# EAGLE design Bus_Isolator (EAGLE 6.6.0)
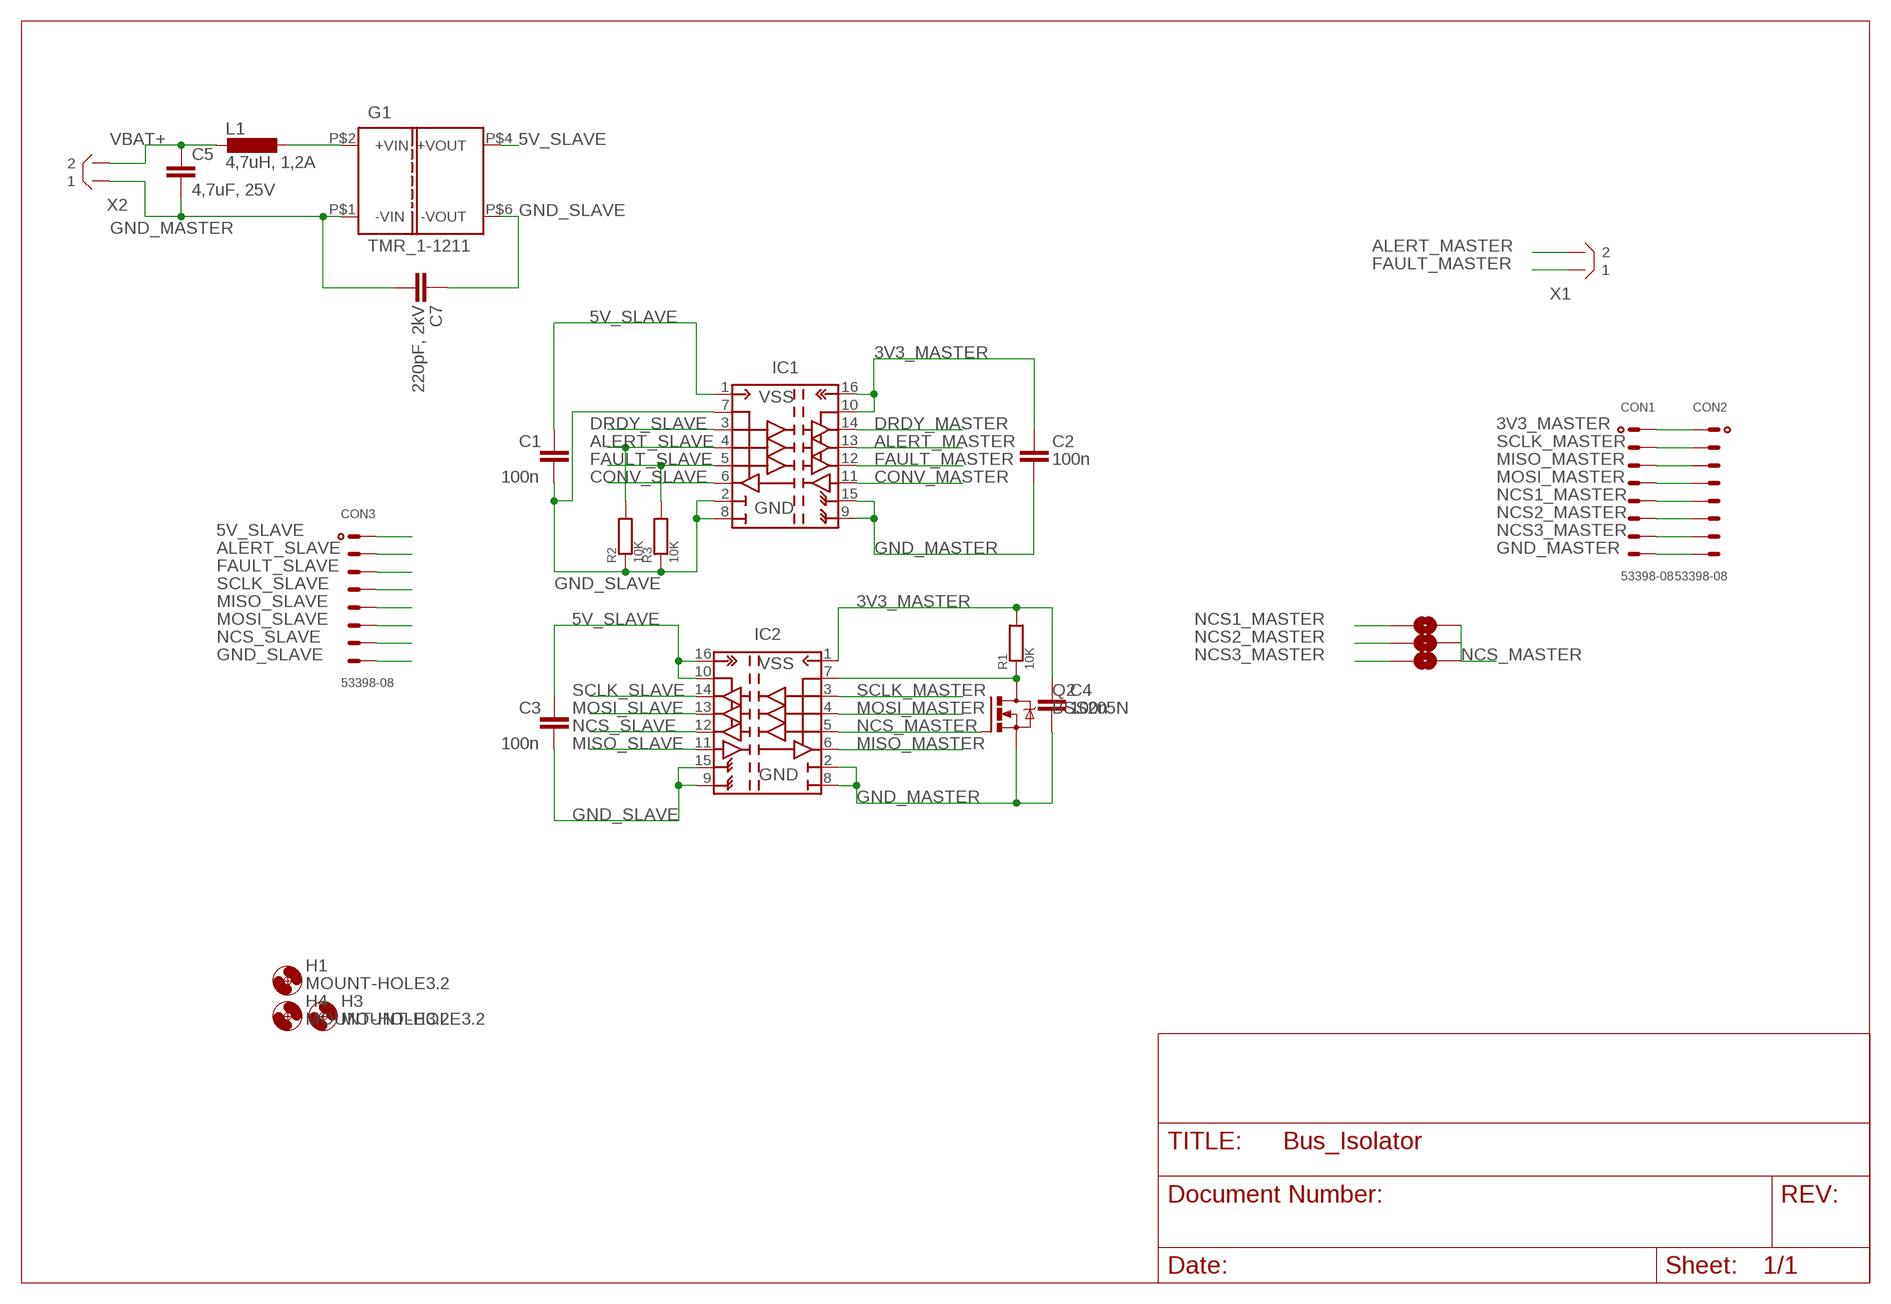
[diagram p0: schematic, sheet 1]

## Parts
C1  100n  CSTD  [C0805]
C2  100n  CSTD  [C0805]
C3  100n  CSTD  [C0805]
C4  100n  CSTD  [C0805]
C5  4,7uF, 25V  C-EUC0805  [C0805]
C7  220pF, 2kV  CC1210_HV  [C1210_HV]
CON1  53398-08  [53398-08]
CON2  53398-08  [53398-08]
CON3  53398-08  [53398-08]
G1  TMR_1-1211  TMR_1-1  [TMR_1-??1?]
H1  MOUNT-HOLE3.2  [3,2]
H3  MOUNT-HOLE3.2  [3,2]
H4  MOUNT-HOLE3.2  [3,2]
IC1  ISO7241  [R-PDSO-G16]
IC2  ISO7241  [R-PDSO-G16]
L1  4,7uH, 1,2A  L-EUL3225M  [L3225M]
Q2  BSS205N  [SOT23]
R1  10K  R  [R0805]
R2  10K  R  [R0805]
R3  10K  R  [R0805]
SJ1  SOLDERJUMPERNO  [SJ_2S-NO]
SJ2  SOLDERJUMPERNO  [SJ_2S-NO]
SJ4  SOLDERJUMPERNO  [SJ_2S-NO]
X1  B2B-XH  [B2B-XH]
X2  B2B-XH  [B2B-XH]

## Nets
3V3_MASTER: C2.2 C4.2 CON1.1 CON2.1 IC1.10(EN2) IC1.16(VCC2) IC2.1(VCC1) R1.2
5V_SLAVE: C1.2 C3.2 CON3.1 G1.P$4(+VOUT) IC1.1(VCC1) IC2.10(EN2) IC2.16(VCC2)
ALERT_MASTER: IC1.13(OUT_B) X1.P$2
ALERT_SLAVE: CON3.2 IC1.4(IN_B) R2.2
CONV_MASTER: IC1.11(IN_D)
CONV_SLAVE: IC1.6(OUT_D)
DRDY_MASTER: IC1.14(OUT_A)
DRDY_SLAVE: IC1.3(IN_A)
FAULT_MASTER: IC1.12(OUT_C) X1.P$1
FAULT_SLAVE: CON3.3 IC1.5(IN_C) R3.2
GND_MASTER: C2.1 C4.1 C5.2 C7.P$1 CON1.8 CON2.8 G1.P$1(-VIN) IC1.9(GND22) IC1.15(GND21) IC2.2(GND11) IC2.8(GND12) Q2.2(S) X2.P$1
GND_SLAVE: C1.1 C3.1 C7.P$2 CON3.8 G1.P$6(-VOUT) IC1.2(GND11) IC1.7(EN1) IC1.8(GND12) IC2.9(GND22) IC2.15(GND21) R2.1 R3.1
MISO_MASTER: CON1.3 CON2.3 IC2.6(OUT_D)
MISO_SLAVE: CON3.5 IC2.11(IN_D)
MOSI_MASTER: CON1.4 CON2.4 IC2.4(IN_B)
MOSI_SLAVE: CON3.6 IC2.13(OUT_B)
N$2: IC2.7(EN1) Q2.3(D) R1.1
N$5: G1.P$2(+VIN) L1.1
NCS1_MASTER: CON1.5 CON2.5 SJ1.1
NCS2_MASTER: CON1.6 CON2.6 SJ2.1
NCS3_MASTER: CON1.7 CON2.7 SJ4.1
NCS_MASTER: IC2.5(IN_C) Q2.1(G) SJ1.2 SJ2.2 SJ4.2
NCS_SLAVE: CON3.7 IC2.12(OUT_C)
SCLK_MASTER: CON1.2 CON2.2 IC2.3(IN_A)
SCLK_SLAVE: CON3.4 IC2.14(OUT_A)
VBAT+: C5.1 L1.2 X2.P$2

## Library data of the parts
C1-C4 C7 = useful:C
C5 = rcl:C-EU: CAPACITOR, European symbol
CON1-CON3 = con-molex:53?-08: CONNECTOR wire to board 1.25 mm (.049 inch) pitch header
G1 = traco-power:TMR_1-??1?
H1 H3 H4 = holes:MOUNT-HOLE: MOUNTING HOLE with drill center marker
IC1 IC2 = ti:ISO7241
L1 = rcl:L-EU: INDUCTOR, European symbol
Q2 = infineon:BSS205N: Infineon Small Signal Transistor, OptiMOS 2 Technology, 20V, 2.5A SOT23
R1-R3 = useful:R
SJ1 SJ2 SJ4 = jumper:SOLDERJUMPER: Solder Jumper Standard SMD solder jumper. Used to automate production. Two varients : Normally Open and Normally Closed are the same, but have different paste layers. NC will have a large amount of paste and should jumper during reflow.
X1 X2 = con-jst-xh:?2B-XH

## Board
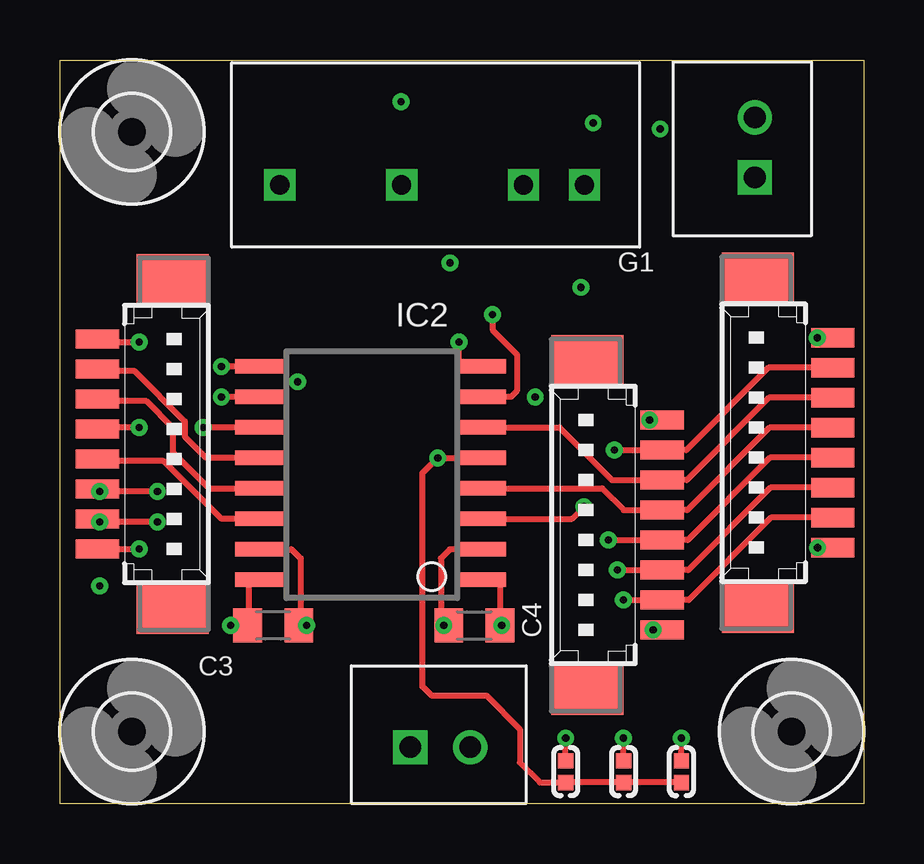
[diagram p1: board, top side]
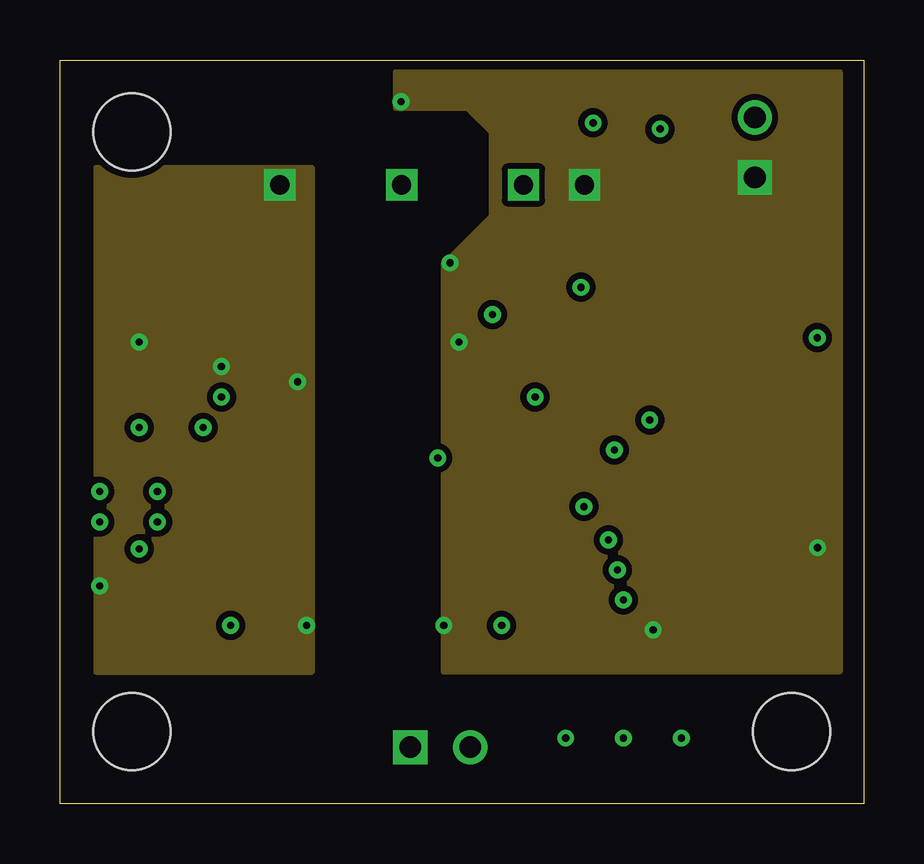
[diagram p2: board, inner layer Route2]
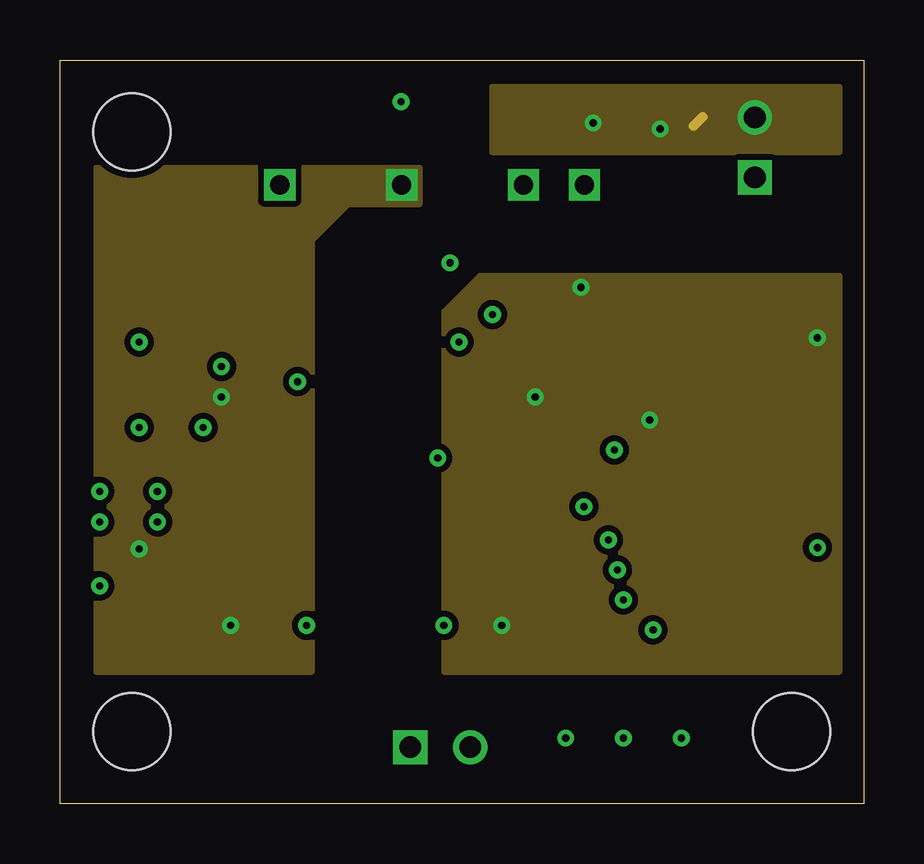
[diagram p3: board, inner layer Route15]
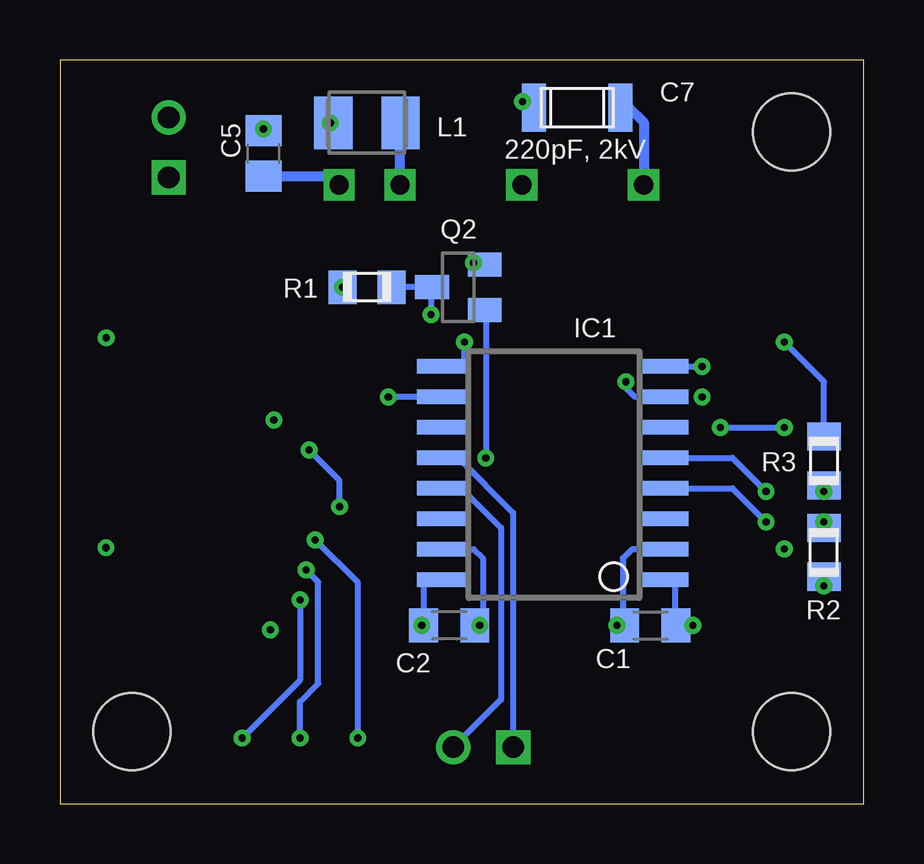
[diagram p4: board, bottom side, seen from below]

Size 33.5 x 31 mm. Coordinates in mm from the lower left corner, seen from the top.
Outline: 0,31 33.5,31 33.5,0 0,0 0,31
Copper layers (1+2*15+16): Top 0.035mm / dielectric 0.2mm / Route2 0.035mm / dielectric 0.5mm / Route15 0.035mm / dielectric 0.2mm / Bottom 0.035mm
Design rules "ats_35u_4layer_2 *": minimum track width 10mil, minimum drill 0.2mm, track to track 10mil, track to pad 10mil, pad to pad 10mil, via to via 10mil, smd to smd 10mil, copper to edge 0.3mm, drill to drill 8mil, minimum pad ring 10mil, minimum via ring 0.2mm, stop-mask expansion 4mil, vias tented up to drill 0mil, thermal gap 10mil

### Footprints (pad centres in the part's own frame; a part is rotated, then mirrored left to right if it is on the bottom)
C0805 = smd 1.2 x 1.4: 1 -1.066,0; 2 1.066,0
C0805' = smd 1.3 x 1.5: 1 -0.95,0; 2 0.95,0
C1210_HV = smd 1 x 2: P$1 -1.8,0; P$2 1.8,0
53398-08 = smd 0.8 x 1.8: 1 4.375,-2.5; 2 3.125,-2.5; 3 1.875,-2.5; 4 0.625,-2.5; 5 -0.625,-2.5; 6 -1.875,-2.5; 7 -3.125,-2.5; 8 -4.375,-2.5 | smd 2.1 x 3: S1 6.875,0.625; S2 -6.875,0.625
TMR_1-??1? = drill 0.8 square: P$1 0,0; P$2 2.54,0; P$4 7.62,0; P$6 12.7,0
3,2 = hole 3.2: 0,0
R-PDSO-G16 = smd 0.6 x 2: 1 -3.937,-4.649; 2 -2.667,-4.649; 3 -1.397,-4.649; 4 -0.127,-4.649; 5 1.143,-4.649; 6 2.413,-4.649; 7 3.683,-4.649; 8 4.953,-4.649; 9 4.953,4.651; 10 3.683,4.651; 11 2.413,4.651; 12 1.143,4.651; 13 -0.127,4.651; 14 -1.397,4.651; 15 -2.667,4.651; 16 -3.937,4.651
L3225M = smd 1.6 x 2.2: 1 -1.4,0; 2 1.4,0
SOT23 = smd 1 x 1.4: 1 -0.95,-1.1; 2 0.95,-1.1; 3 0,1.1
R0805 = smd 1.168 x 1.397: 1 -1.016,0; 2 1.016,0
SJ_2S-NO = smd 0.635 x 0.635: 1 -0.45,0; 2 0.45,0
B2B-XH = drill 0.9 pad 1.422 square: P$1 0,0 | drill 0.9 pad 1.422: P$2 2.5,0

### Placement (x,y rotation side)
C1  8.89,7.43 0 bottom
C2  17.27,7.43 180 bottom
C3  8.89,7.43 180 top
C4  17.27,7.43 0 top
C5  4,7uF, 25V  [C0805']  25.02,27.11 270 bottom
C7  11.94,29.01 0 bottom
CON1  22.61,11.61 90 top
CON2  29.72,15.04 90 top
CON3  4.06,14.99 270 top
G1  21.86,25.79 180 top
H1  30.5,3 0 top
H3  3,3 0 top
H4  3,28 0 top
IC1  12.95,13.27 90 bottom
IC2  12.95,13.27 90 top
L1  20.7,28.38 180 bottom
Q2  16.89,21.52 90 bottom
R1  20.7,21.52 180 bottom
R2  1.65,10.47 90 bottom
R3  1.65,14.28 270 bottom
SJ1  21.08,1.33 270 top
SJ2  23.5,1.33 270 top
SJ4  25.91,1.33 270 top
X1  14.61,2.35 0 top
X2  28.97,26.11 90 top

### Tracks (layer width: path | path; a pad name or v marks a point on that pad's centre or on a via)
3V3_MASTER  (via drill 0.3)
  Top 0.254: v18.41,7.43 C4.2 18.34,9.33 IC2.1 | CON1.1 v24.59,15.99 | CON2.1 v31.57,19.42
  Bottom 0.254: v18.41,7.43 C4.2 18.34,9.33 IC1.16 | IC1.10 v19.81,16.95
  other vias: 21.72,21.52
  pour Route15 (no thermals): 16,5.5 32.5,5.5 32.5,22 17.5,22 16,20.5
5V_SLAVE  (via drill 0.3)
  Top 0.254: v7.11,7.43 C3.2 7.82,7.5 7.87,7.55 7.87,9.33 IC1.1 | IC2.10 v6.73,16.95 | CON3.1 v3.3,10.62
  Bottom 0.254: IC1.1 7.87,9.33 7.87,7.43 C3.2 v7.11,7.43
  pour Route15 (no thermals): 15,26.5 1.5,26.5 1.5,5.5 10.5,5.5 10.5,23.5 12,25 15,25
ALERT_MASTER
  Bottom 0.254: IC1.13 16.76,13.14 15.11,11.49 15.11,4.34 X1.P$2
ALERT_SLAVE  (via drill 0.3)
  Top 0.254: v4.06,11.74 v1.65,11.74 1.65,11.79 CON3.2
  Bottom 0.254: IC1.4 5.46,13.14 v4.06,11.74 | v1.65,11.74 R2.2
FAULT_MASTER
  Bottom 0.254: IC1.12 16.89,14.41 14.61,12.12 X1.P$1
FAULT_SLAVE  (via drill 0.3)
  Top 0.254: v4.06,13.01 v1.65,13.01 1.56,13.01 CON3.3
  Bottom 0.254: IC1.5 5.46,14.41 v4.06,13.01 | v1.65,13.01 R3.2
GND_MASTER  (via drill 0.3)
  Top 0.254: v16,7.43 C4.1 15.75,7.43 15.88,7.55 15.88,10.22 16.26,10.6 IC2.2 | IC2.8 16.64,18.22 v16.64,19.24 | CON2.8 v31.58,10.67 | CON1.8 v24.73,7.24
  Bottom 0.254: v16,7.43 C4.1 15.75,7.43 15.88,7.55 15.88,10.22 16.26,10.6 IC1.15 | IC1.9 16.64,18.22 v16.64,19.24 | Q2.2 15.75,22.52 v16.26,22.54
  Bottom 0.406: C5.2 22.23,26.16 G1.P$1 | C7.P$1 13.97,29.01 v14.22,29.27
  pour Route2 (no thermals): 16,5.5 16,22.5 18,24.5 18,28 17,29 14,29 14,30.5 32.5,30.5 32.5,5.5
GND_SLAVE  (via drill 0.3)
  Top 0.254: v10.29,7.43 C1.1 10.03,7.5 10.03,10.22 9.65,10.6 IC1.2 | IC1.8 v6.73,18.22 | v3.3,19.24 1.91,19.24 1.87,19.27 1.87,19.29 CON3.8
  Bottom 0.254: IC1.2 9.65,10.6 10.03,10.22 10.03,7.5 C1.1 v10.29,7.43 | IC1.8 v6.73,18.22 | R3.1 1.65,17.59 v3.3,19.24 | R2.1 v1.65,9.08 | IC1.7 9.53,16.95 9.91,17.33 v9.91,17.59
  Bottom 0.406: G1.P$6 9.16,28.4 9.78,29.01 C7.P$2
  pour Route2 (no thermals): 10.5,26.5 1.5,26.5 1.5,5.5 10.5,5.5
MISO_MASTER
  Top 0.254: CON2.3 29.56,16.92 26.13,13.49 CON1.3 23.02,13.49 20.82,15.68 IC2.6
MISO_SLAVE  (via drill 0.3)
  Top 0.254: IC2.11 v5.97,15.68 | v3.3,15.68 1.78,15.68 1.78,15.55 1.56,15.55 CON3.5
  Bottom 0.254: v5.97,15.68 v3.3,15.68
MOSI_MASTER
  Top 0.254: CON2.4 29.58,15.67 26.15,12.24 CON1.4 23.5,12.24 22.6,13.14 IC2.4
MOSI_SLAVE
  Top 0.254: IC2.13 6.22,13.14 4.7,14.66 4.7,15.68 3.61,16.77 1.56,16.77 CON3.6
N$2  (via drill 0.3)
  Top 0.254: v18.03,20.38 18.03,19.75 19.05,18.73 19.05,17.2 18.8,16.95 IC2.7
  Bottom 0.254: 18.03,21.52 v18.03,20.38 | 18.03,21.52 R1.1 | Q2.3 18.03,21.52
N$5
  Bottom 0.406: G1.P$2 19.32,28.35 L1.1
NCS1_MASTER  (via drill 0.3)
  Top 0.254: v22.86,10.99 CON1.5 26.17,10.99 29.6,14.42 CON2.5 | SJ1.1 v21.08,2.73
  Bottom 0.254: v21.08,2.73 21.08,9.21 v22.86,10.99
NCS2_MASTER  (via drill 0.3)
  Top 0.254: SJ2.1 v23.5,2.73 | v23.24,9.74 CON1.6 26.19,9.74 29.62,13.17 CON2.6
  Bottom 0.254: v23.5,2.73 23.5,4.25 22.73,5.01 22.73,9.23 v23.24,9.74
NCS3_MASTER  (via drill 0.3)
  Top 0.254: SJ4.1 v25.91,2.73 | v23.5,8.49 CON1.7 26.21,8.49 29.64,11.92 CON2.7
  Bottom 0.254: v23.5,8.49 23.5,5.14 v25.91,2.73
NCS_MASTER  (via drill 0.3)
  Top 0.254: IC2.5 v15.75,14.41 15.11,13.78 15.11,4.88 15.49,4.5 17.78,4.5 19.18,3.1 19.18,1.71 20,0.88 SJ1.2 SJ2.2 SJ4.2
  Bottom 0.254: v15.75,14.41 15.75,20.25 16.07,20.57 Q2.1
NCS_SLAVE
  Top 0.254: IC2.12 6.1,14.41 5.21,15.3 5.21,15.93 3.12,18.02 1.56,18.02 CON3.7
SCLK_MASTER  (via drill 0.3)
  Top 0.254: v23.11,14.74 CON1.2 26.11,14.74 29.54,18.17 CON2.2 | IC2.3 21.34,11.87 v21.84,12.38
  Bottom 0.254: v21.84,12.38 21.84,13.47 v23.11,14.74
SCLK_SLAVE
  Top 0.254: IC2.14 6.73,11.87 4.33,14.27 1.56,14.27 CON3.4
VBAT+  (via drill 0.3)
  Route15 0.406: 26.42,28.25 26.8,28.63
  Bottom 0.406: L1.2 v22.23,28.38 | C5.1 v25.02,28.12
  pour Route15 (no thermals): 18,29.87 18,27.16 32.5,27.16 32.5,29.87

### Text on the board
tTest: 12VDC | GND | 3V3 | SCLK | MISO | MOSI | CS1 | CS2 | CS3 | GND | Fault | Alert | 1 | 2 | 3 | V3
bTest: TERA TU Graz | BMS Host - Isolator | V3 | Pöschl